# Altium project EC_meter_v2.PrjPcb
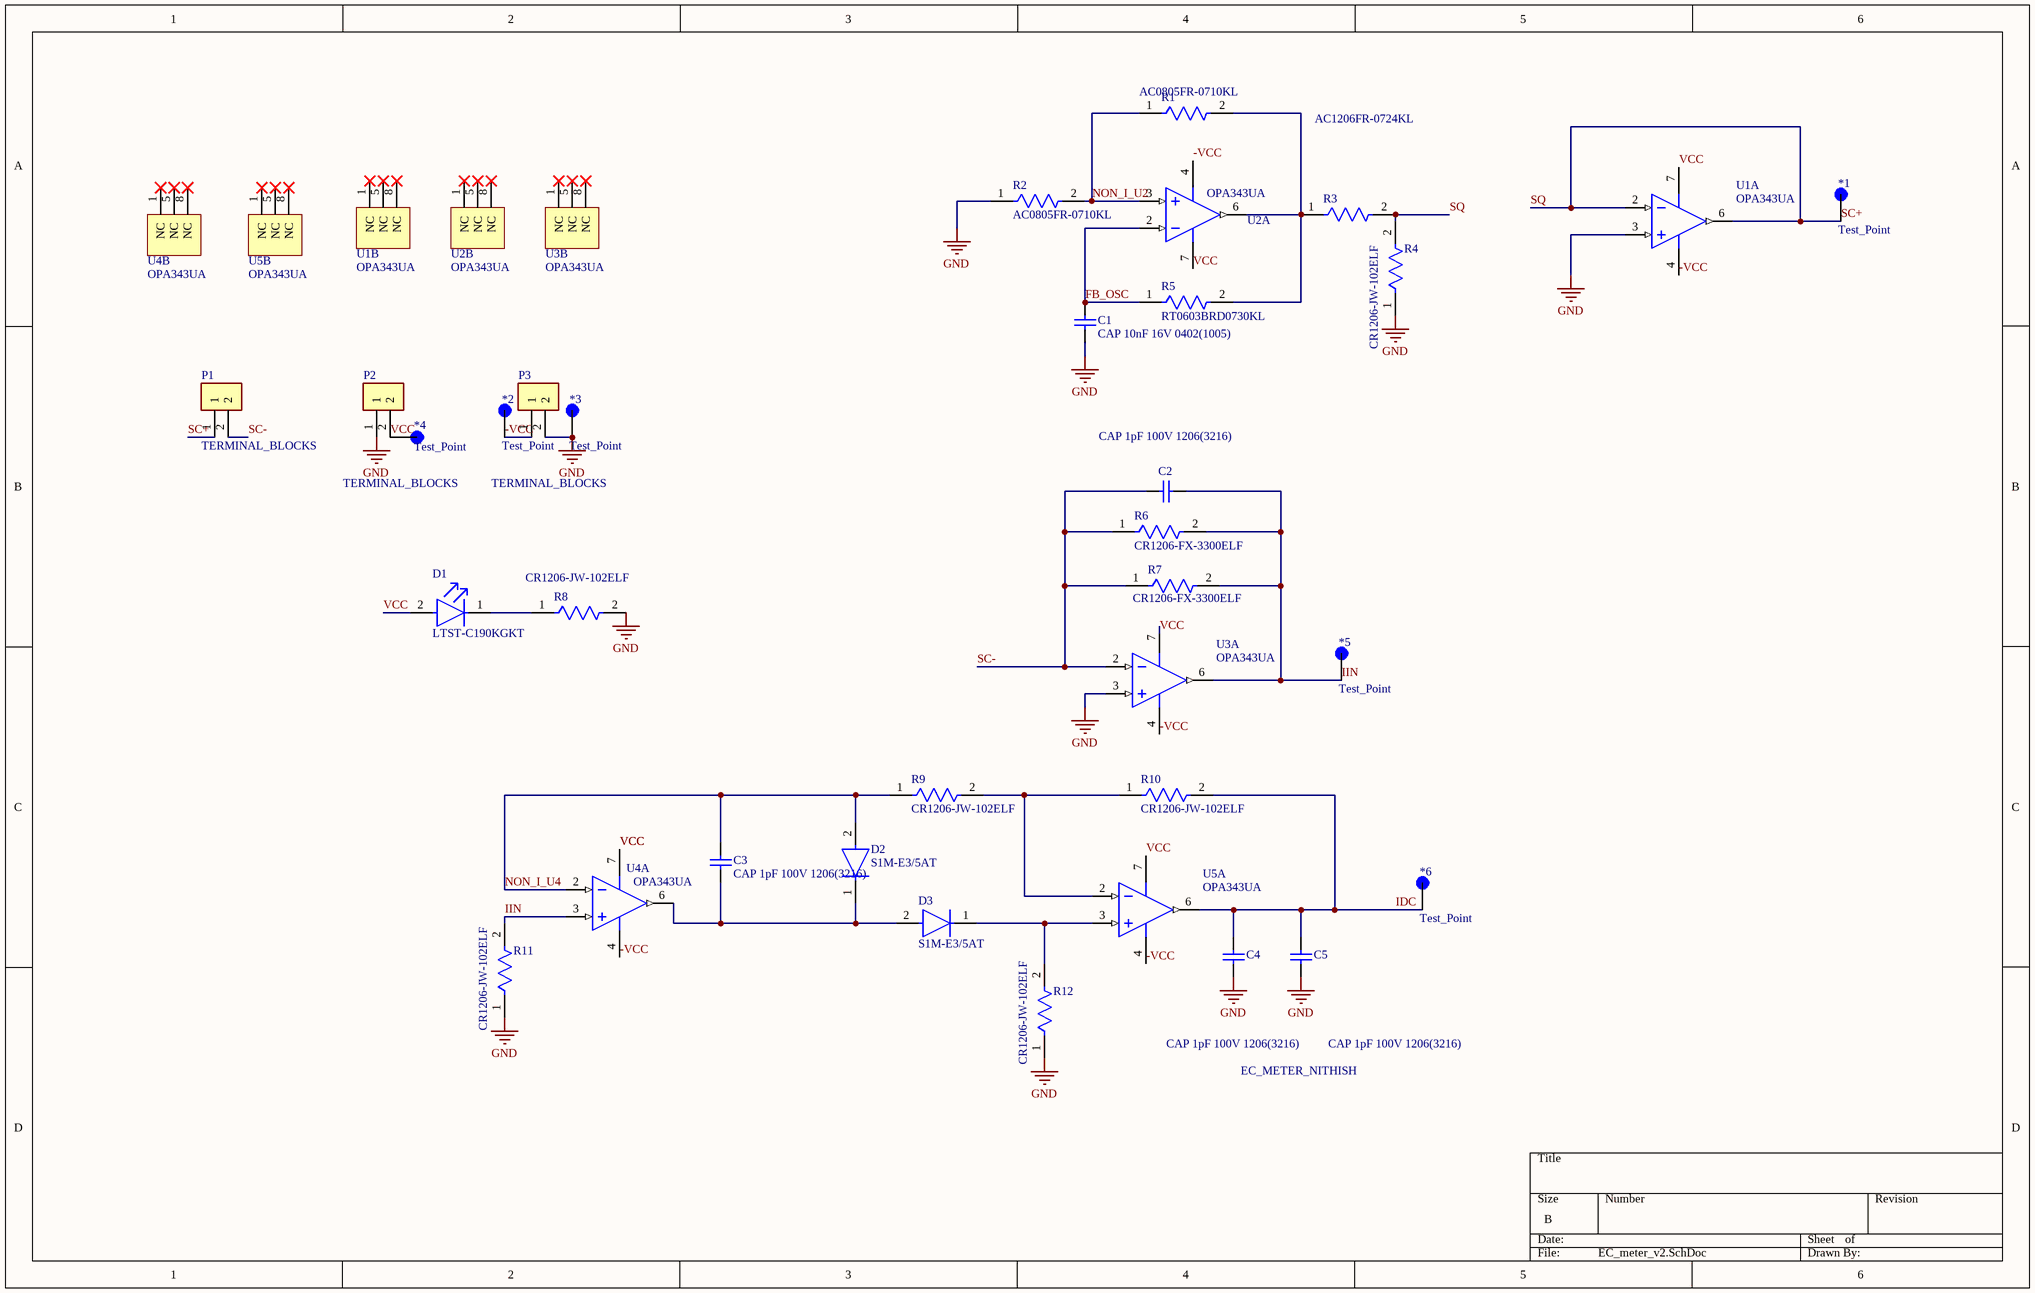
[diagram p0: EC_meter_v2.SchDoc]
1 sheet, 34 parts. Net scope: global (net labels, ports and power ports of the same name join across sheets).
Board file: EC_meter_v2.PcbDoc

## Sheet EC_meter_v2.SchDoc
size B; SheetNumber: 1; SheetTotal: 1

### Parts
*1  Test_Point  [Test_point]
*2  Test_Point  [Test_point]
*3  Test_Point  [Test_point]
*4  Test_Point  [Test_point]
*5  Test_Point  [Test_point]
*6  Test_Point  [Test_point]
C1  CAP 10nF 16V 0402(1005)  [CAPC0402(1005)60_M]
C2  CAP 1pF 100V 1206(3216)  [CAPC1206(3216)170_N]
C3  CAP 1pF 100V 1206(3216)  [CAPC1206(3216)170_N]
C4  CAP 1pF 100V 1206(3216)  [CAPC1206(3216)170_N]
C5  CAP 1pF 100V 1206(3216)  [CAPC1206(3216)170_N]
D1  LTST-C190KGKT  [FP-LTST-C190KGKT-MFG]
D2  S1M-E3/5AT  [FP-95400-MFG]
D3  S1M-E3/5AT  [FP-95400-MFG]
P1  TERMINAL_BLOCKS  [PCBComponent_1 - duplicate]
P2  TERMINAL_BLOCKS  [PCBComponent_1 - duplicate]
P3  TERMINAL_BLOCKS  [PCBComponent_1 - duplicate]
R1  AC0805FR-0710KL  [FP-AC0805-MFG]
R2  AC0805FR-0710KL  [FP-AC0805-MFG]
R3  AC1206FR-0724KL  [FP-AC1206-MFG]
R4  CR1206-JW-102ELF  [FP-CR1206-IPC_C]
R5  RT0603BRD0730KL  [FP-RT0603-0_55-MFG]
R6  CR1206-FX-3300ELF  [FP-CR1206-MFG]
R7  CR1206-FX-3300ELF  [FP-CR1206-MFG]
R8  CR1206-JW-102ELF  [FP-CR1206-IPC_C]
R9  CR1206-JW-102ELF  [FP-CR1206-IPC_C]
R10  CR1206-JW-102ELF  [FP-CR1206-IPC_C]
R11  CR1206-JW-102ELF  [FP-CR1206-IPC_C]
R12  CR1206-JW-102ELF  [FP-CR1206-IPC_C]
U1  OPA343UA  [D0008A_M]  (parts A,B of 2)
U2  OPA343UA  [D0008A_M]  (parts A,B of 2)
U3  OPA343UA  [D0008A_M]  (parts A,B of 2)
U4  OPA343UA  [D0008A_M]  (parts A,B of 2)
U5  OPA343UA  [D0008A_M]  (parts A,B of 2)

### Nets
GND: *3.1(TP) C1.1 C4.1 C5.1 P2.1 P3.2 R2.1 R4.1 R8.2 R11.1 R12.1 U1.3(IN+) U3.3(IN+)
-VCC: *2.1(TP) P3.1 U1.4(V-) U2.4(V-) U3.4(V-) U4.4(V-) U5.4(V-)
FB_OSC: C1.2 R5.1 U2.2(IN-)
IDC: *6.1(TP) C4.2 C5.2 R10.2 U5.6(OUT)
IIN: *5.1(TP) C2.1 R6.2 R7.2 R11.2 U3.6(OUT) U4.3(IN+)
NON_I_U2: R1.1 R2.2 U2.3(IN+)
NON_I_U4: C3.2 D2.2(A) R9.1 U4.2(IN-)
SC+: *1.1(TP) P1.1 R3.2 R4.2 U1.2(IN-) U1.6(OUT)  [also labelled SQ]
SC-: C2.2 P1.2 R6.1 R7.1 U3.2(IN-)
VCC: *4.1(TP) D1.2(A) P2.2 U1.7(V+) U2.7(V+) U3.7(V+) U4.7(V+) U5.7(V+)
NetC3_1: C3.1 D2.1(C) D3.2(A) U4.6(OUT)
NetD1_1: D1.1(C) R8.1
NetD3_1: D3.1(C) R12.2 U5.3(IN+)
NetR1_2: R1.2 R3.1 R5.2 U2.6(OUT)
NetR9_2: R9.2 R10.1 U5.2(IN-)

Not connected (* = marked no-connect by the designer): U1 1(NC)* 5(NC)* 8(NC)*; U2 1(NC)* 5(NC)* 8(NC)*; U3 1(NC)* 5(NC)* 8(NC)*; U4 1(NC)* 5(NC)* 8(NC)*; U5 1(NC)* 5(NC)* 8(NC)*

### Notes on the sheet
- EC_METER_NITHISH

### Library data of the parts
C1 = CMP-1034-01878-1: CAP 10nF 16V -20% to +80% 0402 (1005 Metric) Thickness 0.6mm SMD; Case-Metric: 1005; Case-EIA: 0402; Rated Voltage: 16 V; Max Thickness: 0.6 mm; Tolerance: -20% to +80%; Value: 10nF; Technology: SMT
C2-C5 = CMP-1037-00028-1: CAP 1pF 100V ±0.25pF 1206 (3216 Metric) Thickness 1.7mm SMD; Case-Metric: 3216; Tolerance: Â±0.25pF; Case-EIA: 1206; Rated Voltage: 100 V; Max Thickness: 1.7 mm; Value: 1pF; Technology: SMT
D1 = CMP-2000-05197-2: LED GREEN CLEAR CHIP SMD; Test Current: 20mA; Power Rating: 75mW; Forward Voltage: 2V; Wavelength: 574nm; Number of LEDs: 1; Reverse Voltage: 5V; Dominant Wavelength: 571nm; Lens Style: Diffused; Luminous Intensity: 35mcd; Forward Current: 30mA; Viewing Angle: 130°; Lens Color: Colorless; Width: 0.8mm; Case Code (Imperial): 0603; Case Code (Metric): 1608; Number of Pins: 2; Radiation Hardening: No; Package Quantity: 1; Lead Free: Lead Free; Lens Transparency: Clear; Depth: 0.8mm; Power Dissipation: 75mW; Mount: Surface Mount; Max Operating Temperature: 85°C; Case/Package: 0603; Height: 0.8mm; Illumination Color: Green; Color: Green; Length: 1.6mm; Packaging: Tape and Reel; Number of Elements: 1; Min Operating Temperature: -55°C
D2 D3 = CMP-02540-000018-1: DIODE GEN PURP 1KV 1A DO214AC; Manufacturer: Vishay; Value: 12pF; Max Repetitive Reverse Voltage: 1000V; Max Surge Forward Current: 30A; Peak Reverse Current: 5uA; Max Junction Temp: +150°C; Standoff Height: 0mm; Category: Diode; Temperature: -55°C to +150°C; Digikey Description: DIODE GEN PURP 1KV 1A DO214AC; Lead Free: Yes; Device Class L1: Discrete Semiconductors; Height: 2.29mm; Package: 95400; RoHS: TRUE; Capacitance: 12pF; ComponentLink2URL: http://www.vishay.com/docs/88711/s1.pdf; Mouser Description: Rectifiers 1.0 Amp 1000 Volt 30A IFSM @ 8.3ms; Octopart: https://octopart.com/s1m-e3%2F5at-vishay-42334588; Device Class L3: Rectifier Diodes; Forward Current: 1A; Automotive: No; Footprint Url: http://www.vishay.com/docs/95400/sma.pdf; ComponentLink2Description: Datasheet; Manufacturer Part Number: S1M-E3/5AT; Temperature Range Low: -55°C; Temperature Range High: +150°C; Device Class L2: Diodes
R1 R2 = CMP-2001-04480-2: RES SMD 10K OHM 1% 1/8W 0805; Manufacturer: Yageo; Voltage Rating: 150V; Automotive Grade: Grade 0; Resistance: 10KΩ; Value: 10KΩ; Tolerance: 0.01; Temperature: -55°C to +155°C; Device Class L2: Resistors; RoHS: TRUE; Octopart: https://octopart.com/ac0805fr-0710kl-yageo-21711112; Ipc Land Pattern Name: RESC200125X50; Manufacturer Part Number: AC0805FR-0710KL; ComponentLink2Description: Datasheet; Footprint Url: http://www.yageo.com/exep/pages/download/literatures/PYu-R_Mount_10.pdf; Temperature Range High: +155°C; Digikey Description: RES SMD 10K OHM 1% 1/8W 0805; Package: AC0805; Automotive: Yes; Mouser Description: Res Thick Film 0805 10K Ohm 1% 0.125W(1/8W) ±100ppm/C Epoxy Pad SMD Automotive T/R; Series: AC; ComponentLink2URL: http://www.yageo.com/documents/recent/PYu-AC_51_RoHS_L_6.pdf; Composition: Thick Film; Device Class L3: Chip SMD Resistors; Temperature Range Low: -55°C; Power Rating: 1/8W; Device Class L1: Passive Components; Height: 0.6mm; Lead Free: Yes; Category: Res
R3 = CMP-03412-000204-1: RES SMD 24K OHM 1% 1/4W 1206; Manufacturer: Yageo; Tolerance: 0.01; Power Rating: 0.25W; Value: 24KΩ; Automotive Grade: Grade 0; Voltage Rating: 200V; Temperature Range Low: -55°C; Composition: Thick Film; Octopart: https://octopart.com/ac1206fr-0724kl-yageo-30511081; Device Class L2: Resistors; Temperature Range High: +155°C; Device Class L1: Passive Components; ComponentLink2Description: Datasheet; Manufacturer Part Number: AC1206FR-0724KL; Resistance: 24KΩ; Series: AC; Automotive: Yes; Mouser Description: RES SMD 24K OHM 1% 1/4W 1206; RoHS: TRUE; ComponentLink2URL: http://www.yageo.com/NewPortal/yageodocoutput?fileName=/pdf/R-Chip/PYu-AC_51_RoHS_L_6.pdf; Temperature: -55°C to +155°C; Lead Free: Yes; Category: Res; Device Class L3: Chip SMD Resistors; Package: AC1206; Footprint Url: http://www.yageo.com/exep/pages/download/literatures/PYu-R_Mount_10.pdf; Ipc Land Pattern Name: RESC310160X55; Digikey Description: RES SMD 24K OHM 1% 1/4W 1206; Height: 0.65mm
R4 R8-R12 = CMP-07231-001820-1: Thick Film Chip Resistors 1206 1kΩ 0.25W 5% 200ppm/°C; Voltage Rating: 200V; Resistance: 1kR; Power Rating: 250mW; Number of Pins: 2; Packaging: Tape and Reel; Termination: SMD/SMT; Case Code (Imperial): 1206; Radiation Hardening: No; Height: 0.6mm; Temperature Coefficient: 200ppm/°C; Mount: Surface Mount; Case Code (Metric): 3216; Case/Package: 1206; Thickness: 610um; Voltage Rating (DC): 200V; Military Standard: Not; Width: 1.6mm; Min Operating Temperature: -55°C; Length: 3.2mm; Depth: 1.6mm; REACH SVHC: No SVHC; Contact Plating: Tin; Tolerance: 5%; Package Quantity: 5000; Composition: Thick Film; Max Operating Temperature: 155°C
R5 = CMP-2000-04435-3: NexarPartId: 1243756; Voltage Rating: 75V; Tolerance: 0.1%; Voltage Rating (DC): 50V; Power Rating: 100mW; Resistance: 30kΩ; Temperature Coefficient: 25ppm/°C; Min Operating Temperature: -55°C; Height: 550µm; Military Standard: Not; RoHS: Compliant; Length: 1.6mm; Contact Plating: Tin; Case/Package: 0603; Max Operating Temperature: 125°C; Depth: 800µm; Width: 787.4µm; Weight: 2.012816mg; Features: Moisture Resistant; Case Code (Metric): 1608; Lead Free: Lead Free; Schedule B: 8533210045, 8533210045; Number of Terminations: 2; Max Power Dissipation: 100mW; Termination: SMD/SMT; Case Code (Imperial): 0603; Radiation Hardening: No; Composition: Thin Film
R6 R7 = CMP-07231-003158-1: Thick Film Chip Resistors 1206 330Ω 0.25W 1% 100ppm/°C; Voltage Rating: 200V; Max Power Dissipation: 250mW; Resistance: 330R; Radiation Hardening: No; Length: 3.2mm; Number of Pins: 2; Composition: Thick Film; Tolerance: 1%; Case Code (Metric): 3216; Max Operating Temperature: 155°C; Number of Terminations: 2; Package Quantity: 5000; Temperature Coefficient: 100ppm/°C; Termination: SMD/SMT; Min Operating Temperature: -55°C; Military Standard: Not; Case/Package: 1206; Packaging: Tape and Reel; Case Code (Imperial): 1206; Contact Plating: Tin; Voltage Rating (DC): 200V; REACH SVHC: No SVHC; Height: 0.6mm; Thickness: 610um; Mount: Surface Mount; Depth: 1.6mm; Power Rating: 250mW; Width: 1.6mm
U1-U5 = CMP-0272-00349-3: Single-Supply, Rail-to-Rail Operational Amplifier MicroAmplifier(TM) Series, 2.5 to 5.5 V, -40 to 85 degC, 8-pin SOIC (D8), Green (RoHS & no Sb/Br); Manufacturer: Texas Instruments; Slew Rate(Typ)(V/us): 6; Iq per channel(Max)(mA): 1.25; CMRR(Min)(dB): 74; Total Supply Voltage(Min)(+5V is 5, +/-5V is 10): 2.5; Rating: Catalog; IIB(Max)(pA): 10; Total Supply Voltage(Max)(+5V is 5, +/-5V is 10): 5.5; Sub Family: High Output Current Amplifier (>=50mA), Low Input Bias Current Amp (<=10pA), Low Supply Voltage Amplifier (<=2.7V), Precision Amplifier; Packing: TUBE; Vio (25C)(Max)(mV): 8; Number of Channels: 1; Offset Drift(Typ)(uV/C): 3; ComponentLink2Description: Datasheet; Mounting Technology: Surface Mount; DatasheetVersion: SBOS090A; PackageDescription: 8-Pin Plastic Small Outline, Body 4.9 x 3.9 mm, Pitch 1.27 mm; ComponentLink1URL: http://www.ti.com/; ComponentLink3Description: Package Specification; PackageReference: D0008A; ComponentLink2URL: http://www.ti.com/lit/ds/symlink/opa343.pdf; ComponentLink3URL: http://www.ti.com/litv/pdf/msoi002j; Eco-Plan: Green (RoHS & no Sb/Br); PackageVersion: 4040047-3/M, 06/2011; PartNumber: OPA343UA; GBW(Typ)(MHz): 5.5; ComponentLink1Description: Manufacturer URL; Code_JEDEC: MS-012